# Altium project Front.PrjPCB (part 1 of 2)
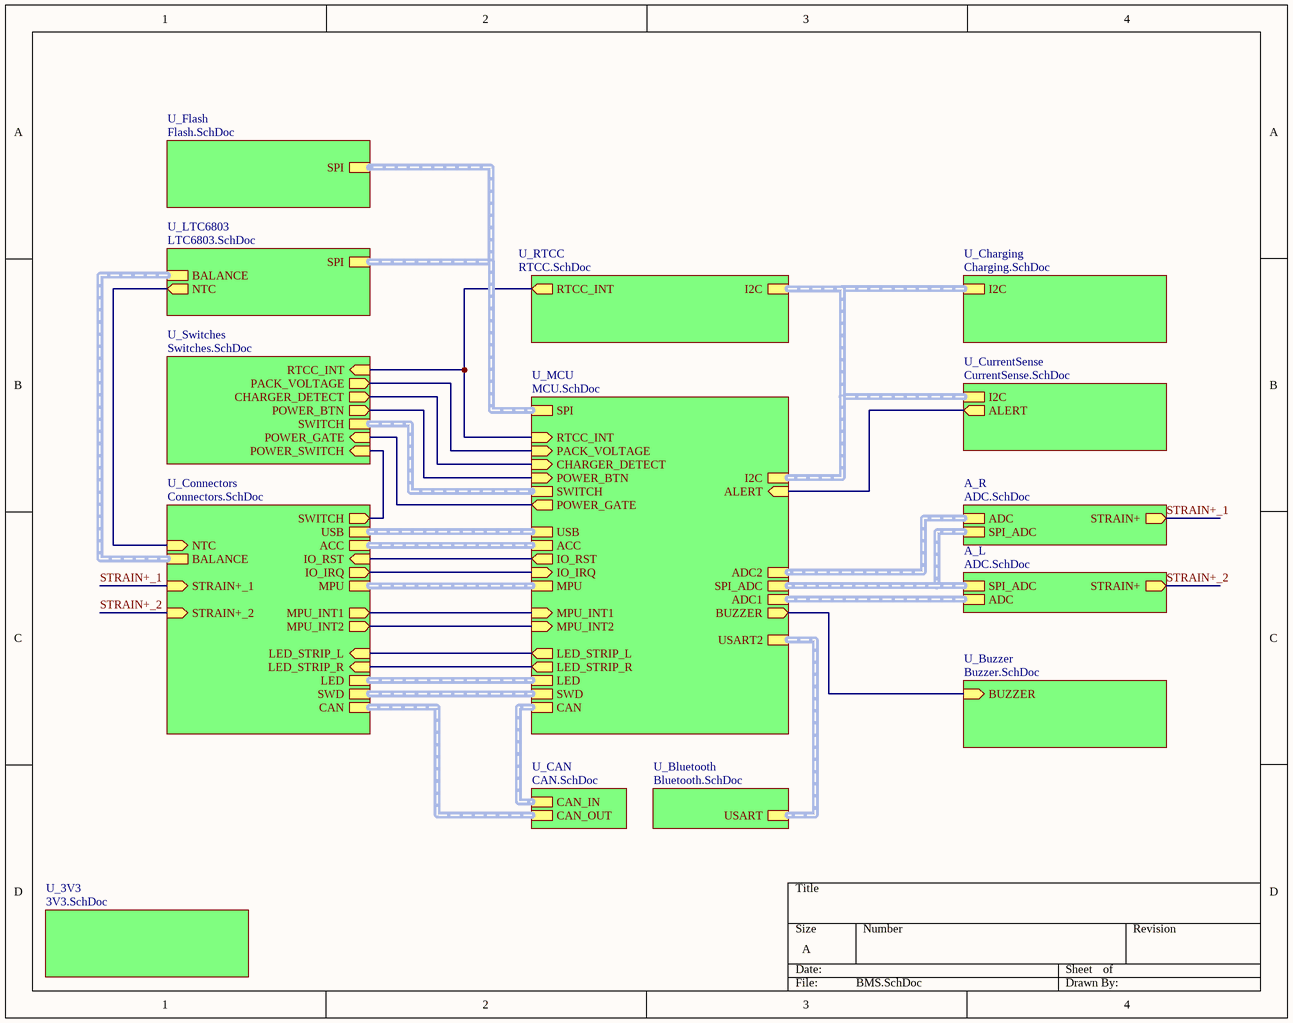
[diagram p0: BMS.SchDoc]
15 sheets, 320 parts. Net scope: hierarchical (ports join the sheet entries above them; power ports are global).
Board file: Front.PcbDoc
Sheets:
  BMS.SchDoc
    U_3V3 = 3V3.SchDoc
    U_MCU = MCU.SchDoc
    U_Switches = Switches.SchDoc
    U_Connectors = Connectors.SchDoc
    U_CAN = CAN.SchDoc
    U_RTCC = RTCC.SchDoc
    U_Buzzer = Buzzer.SchDoc
    A_L = ADC.SchDoc
    U_Charging = Charging.SchDoc
    U_Bluetooth = Bluetooth.SchDoc
    A_R = ADC.SchDoc
    U_CurrentSense = CurrentSense.SchDoc
    U_LTC6803 = LTC6803.SchDoc
      12 = Cell.SchDoc
      11 = Cell.SchDoc
      10 = Cell.SchDoc
      9 = Cell.SchDoc
      8 = Cell.SchDoc
      7 = Cell.SchDoc
      6 = Cell.SchDoc
      5 = Cell.SchDoc
      4 = Cell.SchDoc
      3 = Cell.SchDoc
      2 = Cell.SchDoc
      1 = Cell.SchDoc
    U_Flash = Flash.SchDoc

## Sheet BMS.SchDoc
size A; SheetNumber: 1

### Sub-sheets
A_L = ADC.SchDoc: SPI_ADC (harness SPI_ADC), ADC (harness ADC), STRAIN+ (out)
A_R = ADC.SchDoc: SPI_ADC (harness SPI_ADC), ADC (harness ADC), STRAIN+ (out)
U_3V3 = 3V3.SchDoc: no entries
U_Bluetooth = Bluetooth.SchDoc: USART (harness USART2)
U_Buzzer = Buzzer.SchDoc: BUZZER (in)
U_CAN = CAN.SchDoc: CAN_IN (harness CAN Input), CAN_OUT (harness CAN Output)
U_Charging = Charging.SchDoc: I2C (harness I2C)
U_Connectors = Connectors.SchDoc: USB (harness USB), ACC (harness Accessory Outputs), SWITCH (out), CAN (harness CAN Output), NTC (in), BALANCE (harness Balance), MPU (harness I2C), MPU_INT1 (out), MPU_INT2 (out), STRAIN+_1 (in), STRAIN+_2 (in), LED_STRIP_L (in), LED_STRIP_R (in), SWD (harness SWD), LED (harness LED), IO_RST (in), IO_IRQ (out)
U_CurrentSense = CurrentSense.SchDoc: ALERT (out), I2C (harness I2C)
U_Flash = Flash.SchDoc: SPI (harness SPI)
U_LTC6803 = LTC6803.SchDoc: SPI (harness SPI), NTC (out), BALANCE (harness Balance)
U_MCU = MCU.SchDoc: CHARGER_DETECT (in), POWER_BTN (in), POWER_GATE (out), USB (harness USB), CAN (harness CAN Input), ACC (harness Accessory Outputs), SWITCH (harness Switches), I2C (harness I2C), RTCC_INT (in), PACK_VOLTAGE (in), BUZZER (out), SPI_ADC (harness SPI_ADC), USART2 (harness USART2), ADC1 (harness ADC), ADC2 (harness ADC), MPU (harness I2C), MPU_INT1 (in), MPU_INT2 (in), ALERT (in), SPI, LED_STRIP_L (out), LED_STRIP_R (out), SWD (harness SWD), LED (harness LED), IO_RST (out), IO_IRQ (in)
U_RTCC = RTCC.SchDoc: I2C (harness I2C), RTCC_INT (out)
U_Switches = Switches.SchDoc: POWER_GATE (in), POWER_BTN (out), CHARGER_DETECT (out), SWITCH (harness Switches), POWER_SWITCH (in), RTCC_INT (in), PACK_VOLTAGE (out)

### Nets
STRAIN+_1: sheet U_Connectors/STRAIN+_1, sheet A_R/STRAIN+  [project net AINP]
STRAIN+_2: sheet U_Connectors/STRAIN+_2, sheet A_L/STRAIN+  [project net AINP]
NetC1_2: sheet U_Connectors/NTC, sheet U_LTC6803/NTC
NetJP4_2: sheet U_Switches/POWER_SWITCH, sheet U_Connectors/SWITCH
NetJP8_2: sheet U_MCU/LED_STRIP_L, sheet U_Connectors/LED_STRIP_L
NetJP9_2: sheet U_MCU/LED_STRIP_R, sheet U_Connectors/LED_STRIP_R
NetJP10_1: sheet U_MCU/MPU_INT1, sheet U_Connectors/MPU_INT1
NetJP11_1: sheet U_MCU/MPU_INT2, sheet U_Connectors/MPU_INT2
NetJP15_1: sheet U_MCU/IO_RST, sheet U_Connectors/IO_RST
NetJP15_2: sheet U_MCU/IO_IRQ, sheet U_Connectors/IO_IRQ
NetQ1_1: sheet U_MCU/POWER_BTN, sheet U_Switches/POWER_BTN
NetQ9_1: sheet U_MCU/RTCC_INT, sheet U_Switches/RTCC_INT, sheet U_RTCC/RTCC_INT
NetQ11_1: sheet U_MCU/POWER_GATE, sheet U_Switches/POWER_GATE
NetQ13_1: sheet U_MCU/BUZZER, sheet U_Buzzer/BUZZER
NetR22_2: sheet U_MCU/PACK_VOLTAGE, sheet U_Switches/PACK_VOLTAGE
NetR39_1: sheet U_MCU/CHARGER_DETECT, sheet U_Switches/CHARGER_DETECT
NetR52_1: sheet U_MCU/ALERT, sheet U_CurrentSense/ALERT

### Buses and harness runs
harness sheet A_L/ADC = sheet U_MCU/ADC1
harness sheet A_L/SPI_ADC = sheet A_R/SPI_ADC = sheet U_MCU/SPI_ADC
harness sheet A_R/ADC = sheet U_MCU/ADC2
harness sheet U_Bluetooth/USART = sheet U_MCU/USART2
harness sheet U_CAN/CAN_IN = sheet U_MCU/CAN
harness sheet U_CAN/CAN_OUT = sheet U_Connectors/CAN
harness sheet U_Charging/I2C = sheet U_CurrentSense/I2C = sheet U_MCU/I2C = sheet U_RTCC/I2C
harness sheet U_Connectors/ACC = sheet U_MCU/ACC
harness sheet U_Connectors/BALANCE = sheet U_LTC6803/BALANCE
harness sheet U_Connectors/LED = sheet U_MCU/LED
harness sheet U_Connectors/MPU = sheet U_MCU/MPU
harness sheet U_Connectors/SWD = sheet U_MCU/SWD
harness sheet U_Connectors/USB = sheet U_MCU/USB
harness sheet U_Flash/SPI = sheet U_LTC6803/SPI = sheet U_MCU/SPI
harness sheet U_MCU/SWITCH = sheet U_Switches/SWITCH

## Sheet 3V3.SchDoc
size A; SheetNumber: 2
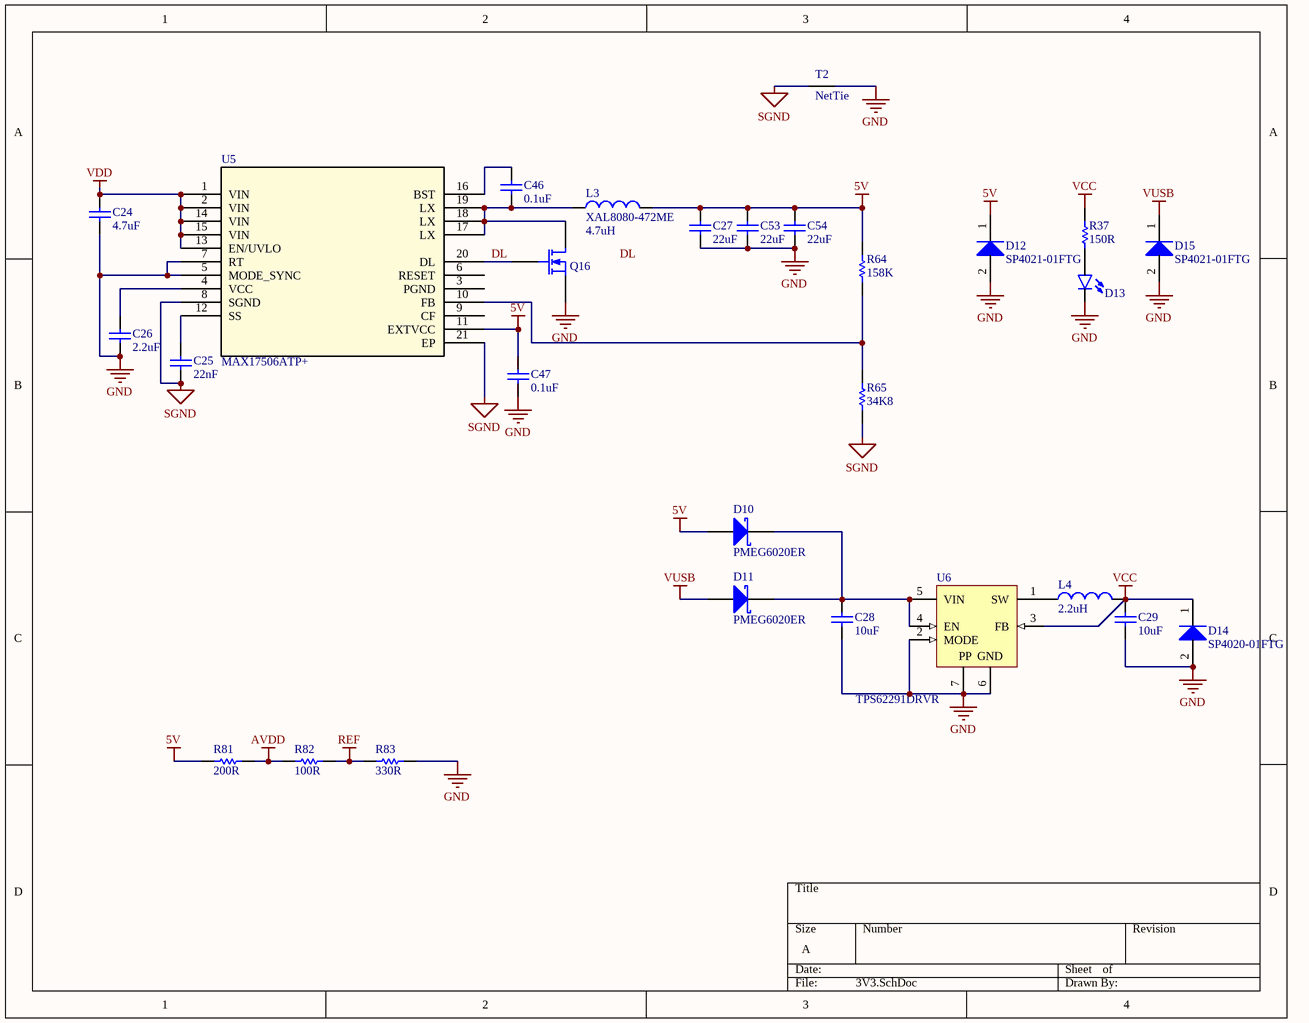
[diagram p1: 3V3.SchDoc]

### Parts
C24  value 4.7uF  [C1210[3225X200]]  (hidden comment: 4.7uF 100V 1210)
C25  value 22nF  [C0603[1608X92]]  (hidden comment: 22nF 50V 0603)
C26  value 2.2uF  [C0603[1608X92]]  (hidden comment: 2.2uF 10V 0603)
C27  value 22uF  [C1210[3225X250]]  (hidden comment: 22uF 16V 1210)
C28  value 10uF  [C0603[1608X92]]  (hidden comment: 10uF 16V 0603)
C29  value 10uF  [C0603[1608X92]]  (hidden comment: 10uF 6.3V 0603)
C46  value 0.1uF  [C0603[1608X92]]  (hidden comment: 0.1uF 16V 0603)
C47  value 0.1uF  [C0603[1608X92]]  (hidden comment: 0.1uF 6.3V 0603)
C53  value 22uF  [C1210[3225X250]]  (hidden comment: 22uF 16V 1210)
C54  value 22uF  [C1210[3225X250]]  (hidden comment: 22uF 16V 1210)
D10  PMEG6020ER  [SOD-123]
D11  PMEG6020ER  [SOD-123]
D12  SP4021-01FTG  [SOD-323]
D13  LED_0603_GREEN_5mA  [LED0603]  (value not drawn)
D14  SP4020-01FTG  [SOD-323]
D15  SP4021-01FTG  [SOD-323]
L3  XAL8080-472ME  value 4.7uH  [XAL8080]
L4  2.2uH  [IND0805]
Q16  SIS862DN-T1-GE3  [PowerPak-1212-8]  (value not drawn)
R37  value 150R  [R0603[1608]]  (hidden comment: 150R 1% 0603)
R64  value 158K  [R0603[1608]]  (hidden comment: 158K 1% 0603)
R65  value 34K8  [R0603[1608]]  (hidden comment: 34K8 1% 0603)
R81  value 200R  [R0603[1608]]  (hidden comment: 200R 1% 0603)
R82  value 100R  [R0603[1608]]  (hidden comment: 100R 1% 0603)
R83  value 330R  [R0603[1608]]  (hidden comment: 330R 1% 0603)
T2  NetTie  [NetTie]  (net tie, no BOM)
U5  MAX17506ATP+  [21-0140L_T2055-4]
U6  TPS62291DRVR  [WSON-6]

### Nets
5V: C27.2 C47.2 C53.2 C54.2 D10.2(A) D12.1(K) L3.2 R64.2 R81.1 U5.11(EXTVCC)
AVDD: R81.2 R82.1
GND: C24.1 C26.1 C27.1 C28.1 C29.1 C47.1 C53.1 C54.1 D12.2(A) D13.C D14.2(A) D15.2(A) Q16.1(S) R83.2 T2.2 U5.5(MODE_SYNC) U5.7(RT) U6.2(MODE) U6.6(GND) U6.7(EP)
REF: R82.2 R83.1
SGND: C25.1 R65.1 T2.1 U5.8(SGND) U5.21(EP)
VCC: C29.2 D14.1(K) L4.2 R37.2 U6.3(FB)
VDD: C24.2 U5.1(VIN) U5.2(VIN) U5.13(EN/UVLO) U5.14(VIN) U5.15(VIN)
VUSB: D11.2(A) D15.1(K)
DL: Q16.2(G) U5.20(DL)
NetC25_2: C25.2 U5.12(SS)
NetC26_2: C26.2 U5.4(VCC)
NetC28_2: C28.2 D10.1(K) D11.1(K) U6.4(EN) U6.5(VIN)
NetC46_1: C46.1 L3.1 Q16.3(D) U5.17(LX) U5.18(LX) U5.19(LX)
NetC46_2: C46.2 U5.16(BST)
NetD13_A: D13.A R37.1
NetL4_1: L4.1 U6.1(SW)
NetR64_1: R64.1 R65.2 U5.10(FB)

Not connected (* = marked no-connect by the designer): U5 3(PGND) 6(RESET) 9(CF)

### Notes on the sheet
- Labels drawn without touching a wire or pin: DL
- (in symbol TPS62291DRVR) PP

### Library data of the parts
C24 = CAP_4.7uF_100V_1210_10%: 4.7uF 100V 10% 1210 (3225 Metric); PartNumber: GRJ32DC72A475KE11L; Manufacturer: Murata; Mounting Technology: Surface Mount; PackageReference: 1210; PackageDescription: 1210 (3225 Metric); Voltage: 100V; Tolerance: 10%
C25 = CAP_22nF_50V_0603_10%: 22nF 50V 10% 0603 (1608 Metric); PartNumber: GRM188R71H223KA01D; Manufacturer: Murata; TemperatureCoefficient: X7R; Mounting Technology: Surface Mount; PackageReference: 0603; PackageDescription: 0603 (1608 Metric); Voltage: 50V; Tolerance: 10%
C26 = CAP_2.2uF_10V_0603_10%: 2.2uF 10V 10% 0603 (1608 Metric); PartNumber: GRT188R61A225KE13D; Manufacturer: Murata; TemperatureCoefficient: X5R; Mounting Technology: Surface Mount; PackageReference: 0603; PackageDescription: 0603 (1608 Metric); Voltage: 10V; Tolerance: 10%
C27 C53 C54 = CAP_22uF_16V_1210_20%_1: 22uF 16V 20% 1210 (3225 Metric); PartNumber: GRM32ER61C476ME15L; Manufacturer: Murata; Mounting Technology: Surface Mount; PackageReference: 1210; PackageDescription: 1210 (3225 Metric); Voltage: 16V; Tolerance: 20%
C28 = CAP_10uF_16V_0603_10%: 10uF 16V 10% 0603 (1608 Metric); PartNumber: GRM188R61C106KAALD; Manufacturer: Murata; TemperatureCoefficient: X5R; Mounting Technology: Surface Mount; PackageReference: 0603; PackageDescription: 0603 (1608 Metric); Voltage: 16V; Tolerance: 10%
C29 = CAP_10uF_6.3V_0603_10%: 10uF 6.3V 10% 0603 (1608 Metric); PartNumber: GRM188R60J106KE47D; Manufacturer: Murata; TemperatureCoefficient: X5R; Mounting Technology: Surface Mount; PackageReference: 0603; PackageDescription: 0603 (1608 Metric); Voltage: 6.3V; Tolerance: 10%
C46 = CAP_0.1uF_16V_0603_10%: 0.1uF 16V 10% 0603 (1608 Metric); PartNumber: GCM188R71C104KA37D; Manufacturer: Murata; TemperatureCoefficient: X7R; Mounting Technology: Surface Mount; PackageReference: 0603; PackageDescription: 0603 (1608 Metric); Voltage: 16V; Tolerance: 10%
C47 = CAP_0.1uF_6.3V_0603_10%: 0.1uF 6.3V 10% 0603 (1608 Metric); PartNumber: GRM188R70J104KA01D; Manufacturer: Murata; Mounting Technology: Surface Mount; PackageReference: 0603; PackageDescription: 0603 (1608 Metric); Voltage: 6.3V; Tolerance: 10%
D10 D11 = PMEG6020ER: PartNumber: PMEG6020ER,115; Manufacturer: NXP Semiconductors; PackageReference: SOD-123W; PackageDescription: SOD, 2-Leads, Body 2.69x1.6mm; Mounting Technology: Surface Mount
D12 D15 = SP4021-01FTG: Manufacturer: Littelfuse; PartNumber: SP4021-01FTG; PackageReference: SOD-323-2; Mounting Technology: Surface Mount
D13 = LED_0603_GREEN_5mA: PartNumber: LTST-C193TGKT-5A; Manufacturer: Lite-On Inc.; PackageReference: 0603; PackageDescription: 0603 (1608 Metric); Mounting Technology: Surface Mount
D14 = SP4020-01FTG: Manufacturer: Littelfuse; PartNumber: SP4020-01FTG; PackageReference: SOD-323-2; Mounting Technology: Surface Mount
L3 = XAL8080-472ME: 4.7uH 38A 4.08mOhms; PartNumber: XAL8080-472MED; Manufacturer: Coilcraft; Published: 8-Jun-2000; PackageReference: 0402-A; Publisher: Altium Limited; PackageDescription: Chip Inductor
L4 = IND_2.2uH_1.7A_0805_20%: 2.2uH 20% 1.7A 0805; PartNumber: LQM21PN2R2MGHL; Manufacturer: Murata; PackageReference: 0805; PackageDescription: 0805 (2012 metric); Value: 2.2uH; Mounting Technology: Surface Mount; Current: 1.7A
Q16 = SIS862DN-T1-GE3: N-Channel MOSFET; Manufacturer: Vishay; PartNumber: SIS862DN-T1-GE3; Mounting Technology: Surface Mount; PackageReference: PowerPAK-1212-8
R37 = RES_150R_0603_1%: 150R 0.25W 1% 0603 (1005 Metric); Manufacturer: Vishay / Dale; PartNumber: CRCW0603150RFKEAHP; Tolerance: 1%; Power: 0.25W; Mounting Technology: Surface Mount; PackageReference: 0603; PackageDescription: 0603 (1608 Metric); ComponentLink1Description: Datasheet; ComponentLink1URL: http://www.vishay.com/docs/20043/crcwhpe3.pdf
R64 = RES_158K_0603_1%: 158K 0.25W 1% 0603 (1005 Metric); Manufacturer: Vishay / Dale; PartNumber: CRCW0603158KFKEAHP; Tolerance: 1%; Power: 0.25W; Mounting Technology: Surface Mount; PackageReference: 0603; PackageDescription: 0603 (1608 Metric); ComponentLink1Description: Datasheet; ComponentLink1URL: http://www.vishay.com/docs/20043/crcwhpe3.pdf
R65 = RES_34K8_0603_1%: 34K8 0.25W 1% 0603 (1005 Metric); Manufacturer: Vishay / Dale; PartNumber: CRCW060334K8FKEAHP; Tolerance: 1%; Power: 0.25W; Mounting Technology: Surface Mount; PackageReference: 0603; PackageDescription: 0603 (1608 Metric); ComponentLink1Description: Datasheet; ComponentLink1URL: http://www.vishay.com/docs/20043/crcwhpe3.pdf
R81 = RES_200R_0603_1%: 200R 0.25W 1% 0603 (1005 Metric); Manufacturer: Vishay / Dale; PartNumber: CRCW0603200RFKEAHP; Tolerance: 1%; Power: 0.25W; Mounting Technology: Surface Mount; PackageReference: 0603; PackageDescription: 0603 (1608 Metric); ComponentLink1Description: Datasheet; ComponentLink1URL: http://www.vishay.com/docs/20043/crcwhpe3.pdf
R82 = RES_100R_0603_1%: 100R 0.25W 1% 0603 (1005 Metric); Manufacturer: Vishay / Dale; PartNumber: CRCW0603100RFKEAHP; Tolerance: 1%; Power: 0.25W; Mounting Technology: Surface Mount; PackageReference: 0603; PackageDescription: 0603 (1608 Metric); ComponentLink1Description: Datasheet; ComponentLink1URL: http://www.vishay.com/docs/20043/crcwhpe3.pdf
R83 = RES_330R_0603_1%: 330R 0.25W 1% 0603 (1005 Metric); Manufacturer: Vishay / Dale; PartNumber: CRCW0603330RFKEAHP; Tolerance: 1%; Power: 0.25W; Mounting Technology: Surface Mount; PackageReference: 0603; PackageDescription: 0603 (1608 Metric); ComponentLink1Description: Datasheet; ComponentLink1URL: http://www.vishay.com/docs/20043/crcwhpe3.pdf
U5 = MAX17506ATP+: Manufacturer: Maxim; Value: Value; Type: Type; RefDes: RefDes; PartNumber: MAX17506ATP+
U6 = TPS62291DRVR: Voltage Regulators - Switching Regulators 2.25MHz 1A Step-Down Cnvrtr 3.3V Output; Manufacturer: Texas Instruments; PartNumber: TPS62291DRVR; PackageReference: WSON-6; PackageDescription: SON, 6-Leads, Body 2x2mm, Pitch 0.65mm, Thermal Pad 1.6x1mm, TI Recommended; Mounting Technology: Surface Mount

## Sheet MCU.SchDoc
size A3; SheetNumber: 3
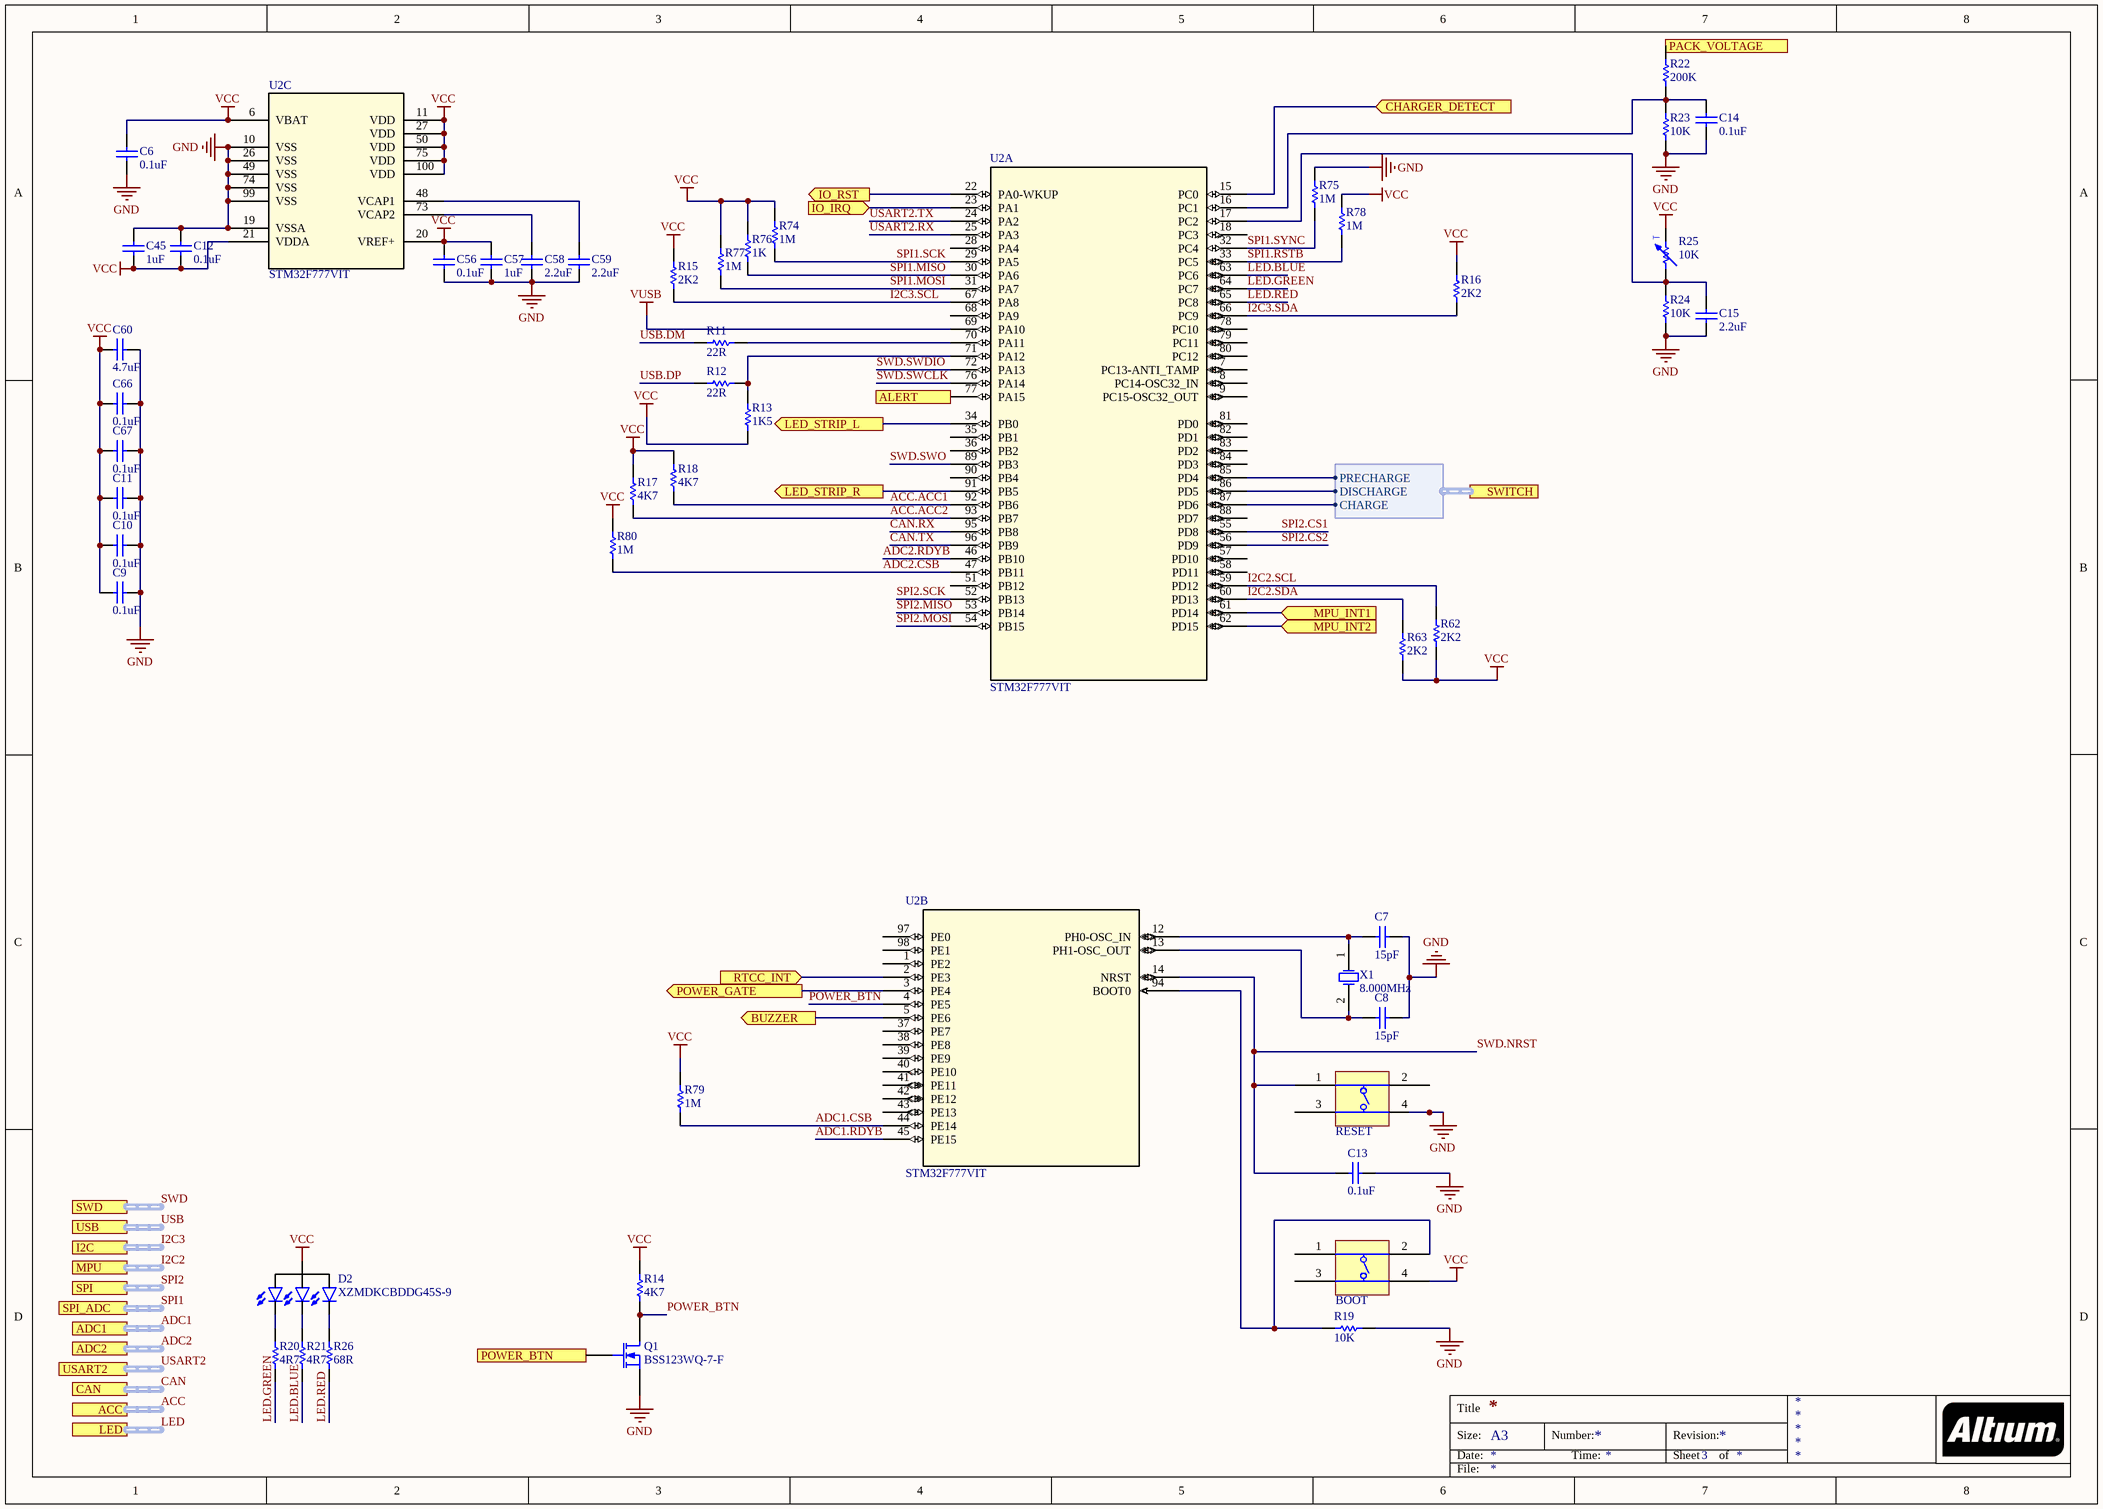
[diagram p2: MCU.SchDoc]

### Parts
BOOT  DIPT-DTSM-6  [SWITCH]  (value not drawn)
C6  value 0.1uF  [C0603[1608X92]]  (hidden comment: 0.1uF 6.3V 0603)
C7  value 15pF  [C0603[1608X92]]  (hidden comment: 15pF 6.3V 0603)
C8  value 15pF  [C0603[1608X92]]  (hidden comment: 15pF 6.3V 0603)
C9  value 0.1uF  [C0603[1608X92]]  (hidden comment: 0.1uF 6.3V 0603)
C10  value 0.1uF  [C0603[1608X92]]  (hidden comment: 0.1uF 6.3V 0603)
C11  value 0.1uF  [C0603[1608X92]]  (hidden comment: 0.1uF 6.3V 0603)
C12  value 0.1uF  [C0603[1608X92]]  (hidden comment: 0.1uF 6.3V 0603)
C13  value 0.1uF  [C0603[1608X92]]  (hidden comment: 0.1uF 6.3V 0603)
C14  value 0.1uF  [C0603[1608X92]]  (hidden comment: 0.1uF 6.3V 0603)
C15  value 2.2uF  [C0603[1608X92]]  (hidden comment: 2.2uF 6.3V 0603)
C45  value 1uF  [C0603[1608X92]]  (hidden comment: 1uF 6.3V 0603)
C56  value 0.1uF  [C0603[1608X92]]  (hidden comment: 0.1uF 6.3V 0603)
C57  value 1uF  [C0603[1608X92]]  (hidden comment: 1uF 6.3V 0603)
C58  value 2.2uF  [C1206[3216X160]]  (hidden comment: 2.2uF 6.3V 1206)
C59  value 2.2uF  [C1206[3216X160]]  (hidden comment: 2.2uF 6.3V 1206)
C60  value 4.7uF  [C0603[1608X92]]  (hidden comment: 4.7uF 6.3V 0603)
C66  value 0.1uF  [C0603[1608X92]]  (hidden comment: 0.1uF 6.3V 0603)
C67  value 0.1uF  [C0603[1608X92]]  (hidden comment: 0.1uF 6.3V 0603)
D2  XZMDKCBDDG45S-9  [XZMDKCBDDG45S-9]
Q1  BSS123WQ-7-F  [SOT323-3]
R11  value 22R  [R0603[1608]]  (hidden comment: 22R 1% 0603)
R12  value 22R  [R0603[1608]]  (hidden comment: 22R 1% 0603)
R13  value 1K5  [R0603[1608]]  (hidden comment: 1K5 1% 0603)
R14  value 4K7  [R0603[1608]]  (hidden comment: 4K7 1% 0603)
R15  value 2K2  [R0603[1608]]  (hidden comment: 2K2 1% 0603)
R16  value 2K2  [R0603[1608]]  (hidden comment: 2K2 1% 0603)
R17  value 4K7  [R0603[1608]]  (hidden comment: 4K7 1% 0603)
R18  value 4K7  [R0603[1608]]  (hidden comment: 4K7 1% 0603)
R19  value 10K  [R0603[1608]]  (hidden comment: 10K 1% 0603)
R20  value 4R7  [R0603[1608]]  (hidden comment: 4R7 1% 0603)
R21  value 4R7  [R0603[1608]]  (hidden comment: 4R7 1% 0603)
R22  value 200K  [R0603[1608]]  (hidden comment: 200K 1% 0603)
R23  value 10K  [R0603[1608]]  (hidden comment: 10K 1% 0603)
R24  value 10K  [R0603[1608]]  (hidden comment: 10K 1% 0603)
R25  value 10K  [R0603[1608]]  (hidden comment: 10K 0.5% 0603)
R26  value 68R  [R0603[1608]]  (hidden comment: 68R 1% 0603)
R62  value 2K2  [R0603[1608]]  (hidden comment: 2K2 1% 0603)
R63  value 2K2  [R0603[1608]]  (hidden comment: 2K2 1% 0603)
R74  value 1M  [R0603[1608]]  (hidden comment: 1M 1% 0603)
R75  value 1M  [R0603[1608]]  (hidden comment: 1M 1% 0603)
R76  value 1K  [R0603[1608]]  (hidden comment: 1K 1% 0603)
R77  value 1M  [R0603[1608]]  (hidden comment: 1M 1% 0603)
R78  value 1M  [R0603[1608]]  (hidden comment: 1M 1% 0603)
R79  value 1M  [R0603[1608]]  (hidden comment: 1M 1% 0603)
R80  value 1M  [R0603[1608]]  (hidden comment: 1M 1% 0603)
RESET  DIPT-DTSM-6  [SWITCH]  (value not drawn)
U2  STM32F777VIT  [LQFP-100_14X14mm]  (parts A,B,C of 3)
X1  8.000MHz  [OSC_2SM_3R2x2R5]

### Ports
ACC (harness Accessory Outputs), ADC1 (harness ADC), ADC2 (harness ADC), ALERT (in), BUZZER (out), CAN (harness CAN Input), CHARGER_DETECT (in), I2C (harness I2C), IO_IRQ (in), IO_RST (out), LED (harness LED), LED_STRIP_L (out), LED_STRIP_R (out), MPU (harness I2C), MPU_INT1 (in), MPU_INT2 (in), PACK_VOLTAGE (in), POWER_BTN (in), POWER_GATE (out), RTCC_INT (in), SPI (harness SPI), SPI_ADC (harness SPI_ADC), SWD (harness SWD), SWITCH (harness Switches), USART2 (harness USART2), USB (harness USB)

### Harnesses
Switches: CHARGE, DISCHARGE, PRECHARGE

### Nets
GND: C6.1 C7.2 C8.2 C9.2 C10.2 C11.2 C12.2 C13.2 C14.1 C15.1 C45.2 C56.1 C57.1 C58.1 C59.1 C60.2 C66.2 C67.2 Q1.2(S) R19.2 R23.1 R24.1 R75.2 RESET.4 U2.10(VSS) U2.19(VSSA) U2.26(VSS) U2.49(VSS) U2.74(VSS) U2.99(VSS)
VCC: BOOT.4 C6.2 C9.1 C10.1 C11.1 C12.1 C45.1 C56.2 C57.2 C60.1 C66.1 C67.1 D2.2(A) R13.1 R14.2 R15.1 R16.1 R17.2 R18.2 R25.2 R62.1 R63.1 R74.1 R76.1 R77.1 R78.2 R79.1 R80.1 U2.6(VBAT) U2.11(VDD) U2.20(VREF+) U2.21(VDDA) U2.27(VDD) U2.50(VDD) U2.75(VDD) U2.100(VDD)
VUSB: U2.69(PA10)
ACC.ACC1: R18.1 U2.92(PB6)
ACC.ACC2: R17.1 U2.93(PB7)
ADC1.CSB: R79.2 U2.44(PE14)
ADC1.RDYB: U2.45(PE15)
ADC2.CSB: R80.2 U2.47(PB11)
ADC2.RDYB: U2.46(PB10)
CAN.RX: U2.95(PB8)
CAN.TX: U2.96(PB9)
I2C2.SCL: R62.2 U2.59(PD12)
I2C2.SDA: R63.2 U2.60(PD13)
I2C3.SCL: R15.2 U2.67(PA8)
I2C3.SDA: R16.2 U2.66(PC9)
LED.BLUE: R21.1 U2.63(PC6)
LED.GREEN: R20.1 U2.64(PC7)
LED.RED: R26.1 U2.65(PC8)
POWER_BTN: Q1.3(D) R14.1 U2.4(PE5)
SPI1.MISO: R76.2 U2.30(PA6)
SPI1.MOSI: R77.2 U2.31(PA7)
SPI1.RSTB: R78.1 U2.33(PC5)
SPI1.SCK: R74.2 U2.29(PA5)
SPI1.SYNC: R75.1 U2.32(PC4)
SPI2.CS1: U2.55(PD8)
SPI2.CS2: U2.56(PD9)
SPI2.MISO: U2.53(PB14)
SPI2.MOSI: U2.54(PB15)
SPI2.SCK: U2.52(PB13)
SWD.NRST: C13.1 RESET.1 U2.14(NRST)
SWD.SWCLK: U2.76(PA14)
SWD.SWDIO: U2.72(PA13)
SWD.SWO: U2.89(PB3)
USART2.RX: U2.25(PA3)
USART2.TX: U2.24(PA2)
USB.DM: R11.1
USB.DP: R12.1
NetBOOT_2: BOOT.2 R19.1 U2.94(BOOT0)
NetC7_1: C7.1 U2.12(PH0-OSC_IN) X1.1(OSC1)
NetC8_1: C8.1 U2.13(PH1-OSC_OUT) X1.2(OSC2)
NetC14_2: C14.2 R22.1 R23.2 U2.16(PC1)
NetC15_2: C15.2 R24.2 R25.1 U2.17(PC2)
NetC58_2: C58.2 U2.73(VCAP2)
NetC59_2: C59.2 U2.48(VCAP1)
NetD2_1: D2.1(K_Red) R26.2
NetD2_3: D2.3(K_Blue) R21.2
NetD2_4: D2.4(K_Green) R20.2
NetJP8_2: U2.34(PB0) ; port LED_STRIP_L
NetJP9_2: U2.91(PB5) ; port LED_STRIP_R
NetJP10_1: U2.61(PD14) ; port MPU_INT1
NetJP11_1: U2.62(PD15) ; port MPU_INT2
NetJP15_1: U2.22(PA0-WKUP) ; port IO_RST
NetJP15_2: U2.23(PA1) ; port IO_IRQ
NetQ1_1: Q1.1(G) ; port POWER_BTN
NetQ9_1: U2.2(PE3) ; port RTCC_INT
NetQ11_1: U2.3(PE4) ; port POWER_GATE
NetQ13_1: U2.5(PE6) ; port BUZZER
NetR11_2: R11.2 U2.70(PA11)
NetR12_2: R12.2 R13.2 U2.71(PA12)
NetR22_2: R22.2 ; port PACK_VOLTAGE
NetR39_1: U2.15(PC0) ; port CHARGER_DETECT
NetR52_1: U2.77(PA15) ; port ALERT
NetU2_85: U2.85(PD4) ; port SWITCH.PRECHARGE
NetU2_86: U2.86(PD5) ; port SWITCH.DISCHARGE
NetU2_87: U2.87(PD6) ; port SWITCH.CHARGE

Not connected (* = marked no-connect by the designer): BOOT 1 3; RESET 2 3; U2 1(PE2) 7(PC13-ANTI_TAMP) 8(PC14-OSC32_IN) 9(PC15-OSC32_OUT) 18(PC3) 28(PA4) 35(PB1) 36(PB2) 37(PE7) 38(PE8) 39(PE9) 40(PE10) 41(PE11) 42(PE12) 43(PE13) 51(PB12) 57(PD10) 58(PD11) 68(PA9) 78(PC10) 79(PC11) 80(PC12) 81(PD0) 82(PD1) 83(PD2) 84(PD3) 88(PD7) 90(PB4) 97(PE0) 98(PE1)

### Buses and harness runs
harness ACC = port ACC
harness ADC1 = port ADC1
harness ADC2 = port ADC2
harness CAN = port CAN
harness I2C2 = port MPU
harness I2C3 = port I2C
harness LED = port LED
harness SPI1 = port SPI_ADC
harness SPI2 = port SPI
harness SWD = port SWD
harness USART2 = port USART2
harness USB = port USB

### Notes on the sheet
- Title
- Size:
- Date:
- A3
- Number:
- Time:
- Revision:
- Sheet
- of
- File:
- (in symbol NTC_10K_0603_0.5%) T

### Library data of the parts
BOOT RESET = DIPT-DTSM-6: Manufacturer: Wurth; PartNumber: 430182050816
C6 C9-C14 C56 C66 C67 = CAP_0.1uF_6.3V_0603_10%: as C47 on sheet 3V3; Mounting Technology: Surface Mount; PackageReference: 0603; PackageDescription: 0603 (1608 Metric); Voltage: 6.3V; Tolerance: 10%
C7 C8 = CAP_15pF_6.3V_0603_1%: 15pF 6.3V 1% 0603 (1608 Metric); PartNumber: CBR02C150F9GAC; Manufacturer: KEMET; TemperatureCoefficient: C0G; Mounting Technology: Surface Mount; PackageReference: 0603; PackageDescription: 0603 (1608 Metric); Voltage: 6.3V; Tolerance: 1%
C15 = CAP_2.2uF_6.3V_0603_10%: 2.2uF 6.3V 10% 0603 (1608 Metric); PartNumber: GRM185R60J225KE26D; Manufacturer: Murata; TemperatureCoefficient: X5R; Mounting Technology: Surface Mount; PackageReference: 0603; PackageDescription: 0603 (1608 Metric); Voltage: 6.3V; Tolerance: 10%
C45 C57 = CAP_1uF_6.3V_0603_10%: 1uF 6.3V 10% 0603 (1608 Metric); PartNumber: GRM188R60J105KA01D; Manufacturer: Murata; TemperatureCoefficient: X5R; Mounting Technology: Surface Mount; PackageReference: 0603; PackageDescription: 0603 (1608 Metric); Voltage: 6.3V; Tolerance: 10%
C58 C59 = CAP_2.2uF_16V_1206_10%: 2.2uF 6.3V 10% 1206 (3216 Metric); PartNumber: GRM31CR60J476KE19L; Manufacturer: Murata; Voltage: 16V; Mounting Technology: Surface Mount; PackageReference: 1206; PackageDescription: 1206 (3216 Metric); Tolerance: 10%
C60 = CAP_4.7uF_6.3V_0603_10%: 4.7uF 6.3V 10% 0603 (1608 Metric); PartNumber: GRM188R60J475KE19D; Manufacturer: Murata; TemperatureCoefficient: X5R; Mounting Technology: Surface Mount; PackageReference: 0603; PackageDescription: 0603 (1608 Metric); Voltage: 6.3V; Tolerance: 10%
D2 = XZMDKCBDDG45S-9: Manufacturer: SunLED; PartNumber: XZMDKCBDDG45S-9; PackageReference: 4-PLCC; Mounting Technology: Surface Mount; PackageDescription: 4-SMD, Gull Wing,  3.20mm L x 2.80mm W
Q1 = BSS123WQ-7-F: N-Channel MOSFET; Manufacturer: Diodes Incorporated; PackageReference: SOT-323-3; PartNumber: BSS123WQ-7-F; Mounting Technology: Surface Mount
R11 R12 = RES_22R_0603_1%: 22R 0.25W 1% 0603 (1005 Metric); Manufacturer: Vishay / Dale; PartNumber: CRCW060322R0FKEAHP; Tolerance: 1%; Power: 0.25W; Mounting Technology: Surface Mount; PackageReference: 0603; PackageDescription: 0603 (1608 Metric); ComponentLink1Description: Datasheet; ComponentLink1URL: http://www.vishay.com/docs/20043/crcwhpe3.pdf
R13 = RES_1K5_0603_1%: 1K5 0.25W 1% 0603 (1005 Metric); Manufacturer: Vishay / Dale; PartNumber: CRCW06031K50FKEAHP; Tolerance: 1%; Power: 0.25W; Mounting Technology: Surface Mount; PackageReference: 0603; PackageDescription: 0603 (1608 Metric); ComponentLink1Description: Datasheet; ComponentLink1URL: http://www.vishay.com/docs/20043/crcwhpe3.pdf
R14 R17 R18 = RES_4K7_0603_1%: 4K7 0.25W 1% 0603 (1005 Metric); Manufacturer: Vishay / Dale; PartNumber: CRCW06034K70FKEAHP; Tolerance: 1%; Power: 0.25W; Mounting Technology: Surface Mount; PackageReference: 0603; PackageDescription: 0603 (1608 Metric); ComponentLink1Description: Datasheet; ComponentLink1URL: http://www.vishay.com/docs/20043/crcwhpe3.pdf
R15 R16 R62 R63 = RES_2K2_0603_1%: 2K2 0.25W 1% 0603 (1005 Metric); Manufacturer: Vishay / Dale; PartNumber: CRCW06032K20FKEAHP; Tolerance: 1%; Power: 0.25W; Mounting Technology: Surface Mount; PackageReference: 0603; PackageDescription: 0603 (1608 Metric); ComponentLink1Description: Datasheet; ComponentLink1URL: http://www.vishay.com/docs/20043/crcwhpe3.pdf
R19 R23 R24 = RES_10K_0603_1%: 10K 0.25W 1% 0603 (1005 Metric); Manufacturer: Vishay; PartNumber: RCS060310K0FKEA; Tolerance: 1%; Power: 0.25W; Mounting Technology: Surface Mount; PackageReference: 0603; PackageDescription: 0603 (1608 Metric); ComponentLink1Description: Datasheet; ComponentLink1URL: http://www.vishay.com/docs/20065/rcse3.pdf
R20 R21 = RES_4R7_0603_1%: 4R7 0.25W 1% 0603 (1005 Metric); Manufacturer: Vishay / Dale; PartNumber: CRCW06034R70JNEAHP; Tolerance: 1%; Power: 0.25W; Mounting Technology: Surface Mount; PackageReference: 0603; PackageDescription: 0603 (1608 Metric); ComponentLink1Description: Datasheet; ComponentLink1URL: http://www.vishay.com/docs/20043/crcwhpe3.pdf
R22 = RES_200K_0603_1%: 200K 0.25W 1% 0603 (1005 Metric); Manufacturer: Rohm Semiconductor; PartNumber: ESR03EZPJ204; Tolerance: 5%; Power: 0.25W; Mounting Technology: Surface Mount; PackageReference: 0603; PackageDescription: 0603 (1608 Metric); ComponentLink1Description: Datasheet; ComponentLink1URL: http://www.vishay.com/docs/20043/crcwhpe3.pdf
R25 = NTC_10K_0603_0.5%: NTC 10K 0.5% 0603 (1608 Metric); PartNumber: NCP18XH103D60RC; Manufacturer: Murata; Power: 0.1W; Mounting Technology: Surface Mount; PackageReference: 0603; PackageDescription: 0603 (1608 Metric); Tolerance: 0.5%
R26 = RES_68R_0603_1%: 68R 0.25W 1% 0603 (1005 Metric); Manufacturer: Vishay / Dale; PartNumber: CRCW06036R80FKEAHP; Tolerance: 1%; Power: 0.25W; Mounting Technology: Surface Mount; PackageReference: 0603; PackageDescription: 0603 (1608 Metric); ComponentLink1Description: Datasheet; ComponentLink1URL: http://www.vishay.com/docs/20043/crcwhpe3.pdf
R74 R75 R77-R80 = RES_1M_0603_1%: 1M 0.25W 1% 0603 (1005 Metric); Manufacturer: Vishay / Dale; PartNumber: CRCW06031M00JNEAHP; Tolerance: 5%; Power: 0.25W; Mounting Technology: Surface Mount; PackageReference: 0603; PackageDescription: 0603 (1608 Metric); ComponentLink1Description: Datasheet; ComponentLink1URL: http://www.vishay.com/docs/20043/crcwhpe3.pdf
R76 = RES_1K_0603_1%: 1K 0.25W 1% 0603 (1005 Metric); Manufacturer: Vishay / Dale; PartNumber: CRCW06031K00FKEAHP; Tolerance: 1%; Power: 0.25W; Mounting Technology: Surface Mount; PackageReference: 0603; PackageDescription: 0603 (1608 Metric); ComponentLink1Description: Datasheet; ComponentLink1URL: http://www.vishay.com/docs/20043/crcwhpe3.pdf
U2 = STM32F777VIT: Imported; Manufacturer: STMicroelectronics; Value: Value; Type: Type; RefDes: RefDes; PartNumber: STM32F777VIT
X1 = XTAL: Crystal Oscillator; Manufacturer: NX; PartNumber: NX3225GD-8.000M-EXS00A-CG04874; PackageReference: R38; Value: 8.000MHz

## Sheet Switches.SchDoc
size A; SheetNumber: 7
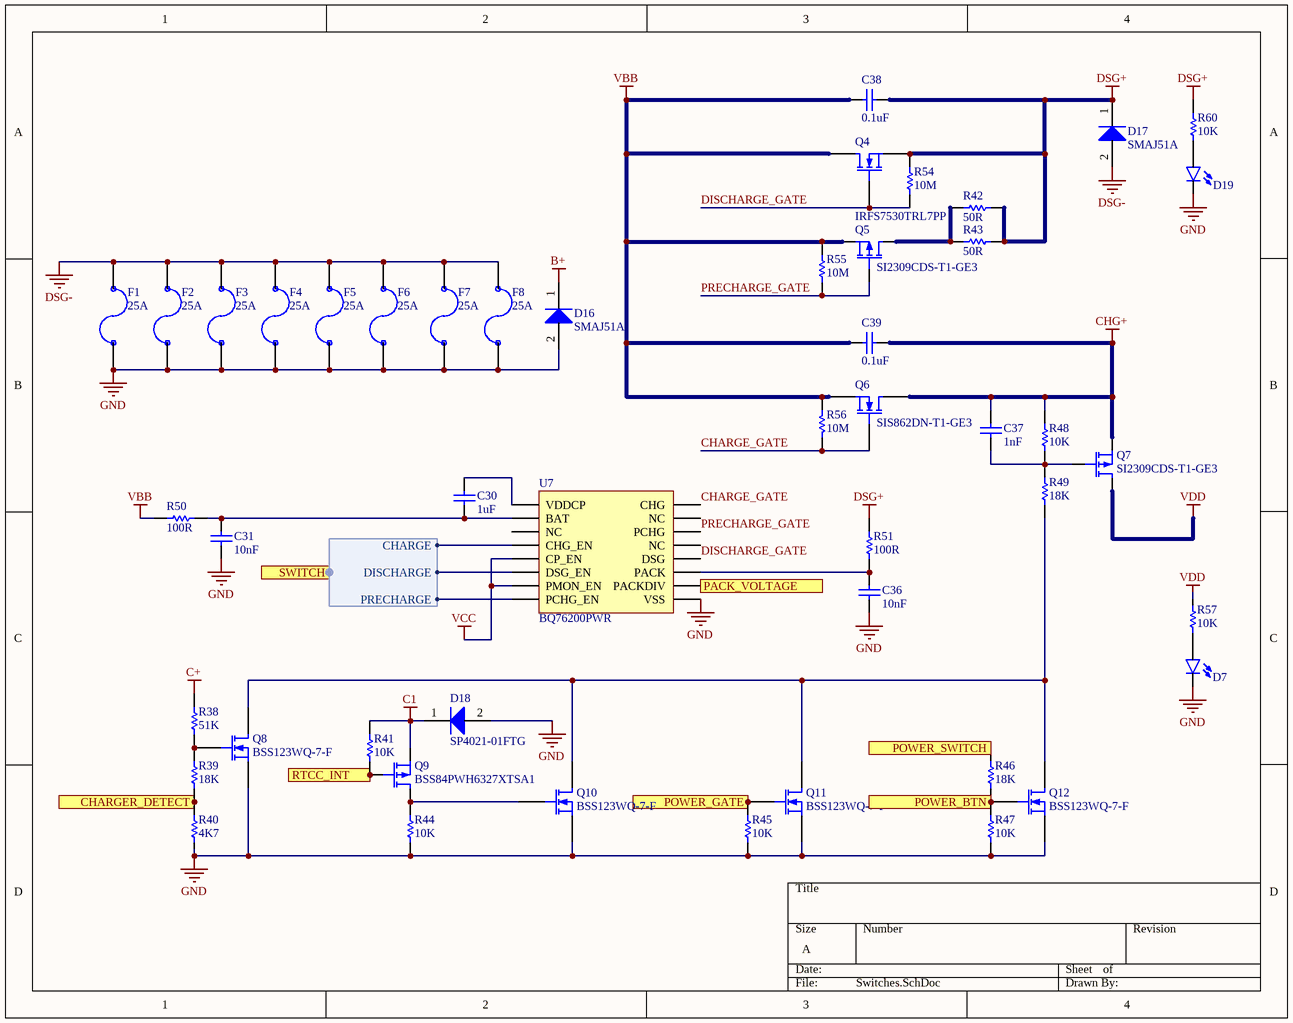
[diagram p3: Switches.SchDoc]

### Parts
C30  value 1uF  [C0603[1608X92]]  (hidden comment: 1uF 50V 0603)
C31  value 10nF  [C0603[1608X92]]  (hidden comment: 10nF 100V 0603)
C36  value 10nF  [C0603[1608X92]]  (hidden comment: 10nF 100V 0603)
C37  value 1nF  [C0603[1608X92]]  (hidden comment: 1nF 50V 0603)
C38  value 0.1uF  [C0603[1608X92]]  (hidden comment: 0.1uF 100V 0603)
C39  value 0.1uF  [C0603[1608X92]]  (hidden comment: 0.1uF 100V 0603)
D7  LED_0603_GREEN_5mA  [LED0603]  (value not drawn)
D16  SMAJ51A  [DO-214AC]
D17  SMAJ51A  [DO-214AC]
D18  SP4021-01FTG  [SOD-323]
D19  LED_0603_GREEN_5mA  [LED0603]  (value not drawn)
F1  Current: 25A  [1206_FUSE]  (hidden comment: FUSE 1206)
F2  Current: 25A  [1206_FUSE]  (hidden comment: FUSE 1206)
F3  Current: 25A  [1206_FUSE]  (hidden comment: FUSE 1206)
F4  Current: 25A  [1206_FUSE]  (hidden comment: FUSE 1206)
F5  Current: 25A  [1206_FUSE]  (hidden comment: FUSE 1206)
F6  Current: 25A  [1206_FUSE]  (hidden comment: FUSE 1206)
F7  Current: 25A  [1206_FUSE]  (hidden comment: FUSE 1206)
F8  Current: 25A  [1206_FUSE]  (hidden comment: FUSE 1206)
Q4  IRFS7530TRL7PP  [D2PAK-7]
Q5  SI2309CDS-T1-GE3  [SOT23-3]
Q6  SIS862DN-T1-GE3  [PowerPak-1212-8]
Q7  SI2309CDS-T1-GE3  [SOT23-3]
Q8  BSS123WQ-7-F  [SOT323-3]
Q9  BSS84PWH6327XTSA1  [SOT323-3]
Q10  BSS123WQ-7-F  [SOT323-3]
Q11  BSS123WQ-7-F  [SOT323-3]
Q12  BSS123WQ-7-F  [SOT323-3]
R38  value 51K  [R0603[1608]]  (hidden comment: 51K 1% 0603)
R39  value 18K  [R0603[1608]]  (hidden comment: 18K 1% 0603)
R40  value 4K7  [R0603[1608]]  (hidden comment: 4K7 1% 0603)
R41  value 10K  [R0603[1608]]  (hidden comment: 10K 1% 0603)
R42  value 50R  [R1206[3216]]  (hidden comment: 50R 2% 1206)
R43  value 50R  [R1206[3216]]  (hidden comment: 50R 2% 1206)
R44  value 10K  [R0603[1608]]  (hidden comment: 10K 1% 0603)
R45  value 10K  [R0603[1608]]  (hidden comment: 10K 1% 0603)
R46  value 18K  [R0603[1608]]  (hidden comment: 18K 1% 0603)
R47  value 10K  [R0603[1608]]  (hidden comment: 10K 1% 0603)
R48  value 10K  [R0603[1608]]  (hidden comment: 10K 1% 0603)
R49  value 18K  [R0603[1608]]  (hidden comment: 18K 1% 0603)
R50  value 100R  [R0603[1608]]  (hidden comment: 100R 1% 0603)
R51  value 100R  [R0603[1608]]  (hidden comment: 100R 1% 0603)
R54  value 10M  [R0603[1608]]  (hidden comment: 10M 1% 0603)
R55  value 10M  [R0603[1608]]  (hidden comment: 10M 1% 0603)
R56  value 10M  [R0603[1608]]  (hidden comment: 10M 1% 0603)
R57  value 10K  [R0603[1608]]  (hidden comment: 10K 1% 0603)
R60  value 10K  [R0603[1608]]  (hidden comment: 10K 1% 0603)
U7  BQ76200PWR  [TSSOP-16]

### Ports
CHARGER_DETECT (out), PACK_VOLTAGE (out), POWER_BTN (out), POWER_GATE (in), POWER_SWITCH (in), RTCC_INT (in), SWITCH (harness Switches)

### Harnesses
Switches: CHARGE, DISCHARGE, PRECHARGE

### Nets
B+: D16.1(K)
C1: D18.1(K) Q9.2(S) R41.2
C+: R38.2
CHG+: C37.2 C39.2 Q6.3(D) Q7.3(S) R48.2
DSG+: C38.2 D17.1(K) Q4.2(S) R42.2 R43.2 R51.2 R54.2 R60.2
DSG-: D17.2(A) F1.1 F2.1 F3.1 F4.1 F5.1 F6.1 F7.1 F8.1
GND: C31.1 C36.1 D7.C D16.2(A) D18.2(A) D19.C F1.2 F2.2 F3.2 F4.2 F5.2 F6.2 F7.2 F8.2 Q8.2(S) Q10.2(S) Q11.2(S) Q12.2(S) R40.1 R44.1 R45.1 R47.1 U7.9(VSS)
VBB: C38.1 C39.1 Q4.3(D) Q5.3(S) Q6.1(S) R50.1 R55.2 R56.2
VCC: U7.5(CP_EN) U7.7(PMON_EN)
VDD: Q7.2(D) R57.2
CHARGE_GATE: Q6.2(G) R56.1 U7.16(CHG)
DISCHARGE_GATE: Q4.1(G) R54.1 U7.12(DSG)
PRECHARGE_GATE: Q5.1(G) R55.1 U7.14(PCHG)
NetC30_1: C30.1 C31.2 R50.2 U7.2(BAT)
NetC30_2: C30.2 U7.1(VDDCP)
NetC36_2: C36.2 R51.1 U7.11(PACK)
NetC37_1: C37.1 Q7.1(G) R48.1 R49.2
NetD7_A: D7.A R57.1
NetD19_A: D19.A R60.1
NetJP4_2: R46.2 ; port POWER_SWITCH
NetQ1_1: Q12.1(G) R46.1 R47.2 ; port POWER_BTN
NetQ5_2: Q5.2(D) R42.1 R43.1
NetQ8_1: Q8.1(G) R38.1 R39.2
NetQ8_3: Q8.3(D) Q10.3(D) Q11.3(D) Q12.3(D) R49.1
NetQ9_1: Q9.1(G) R41.1 ; port RTCC_INT
NetQ9_3: Q9.3(D) Q10.1(G) R44.2
NetQ11_1: Q11.1(G) R45.2 ; port POWER_GATE
NetR22_2: U7.10(PACKDIV) ; port PACK_VOLTAGE
NetR39_1: R39.1 R40.2 ; port CHARGER_DETECT
NetU2_85: U7.8(PCHG_EN) ; port SWITCH.PRECHARGE
NetU2_86: U7.6(DSG_EN) ; port SWITCH.DISCHARGE
NetU2_87: U7.4(CHG_EN) ; port SWITCH.CHARGE

Not connected (* = marked no-connect by the designer): U7 3(NC) 13(NC) 15(NC)

### Library data of the parts
C30 = CAP_1uF_50V_0603_10%: 1uF 50V 10% 0603 (1608 Metric); PartNumber: GRM188R61H105KAALD; Manufacturer: Murata; TemperatureCoefficient: X5R; Tolerance: 10%; Mounting Technology: Surface Mount; PackageReference: 0603; PackageDescription: 0603 (1608 Metric); Voltage: 50V
C31 C36 = CAP_10nF_100V_0603_10%: 10nF 100V 10% 0603 (1608 Metric); PartNumber: GRM188R72A103KA01D; Manufacturer: Murata; TemperatureCoefficient: X7R; Tolerance: 10%; Mounting Technology: Surface Mount; PackageReference: 0603; PackageDescription: 0603 (1608 Metric); Voltage: 100V
C37 = CAP_1nF_50V_0603_5%: 1nF 50V 5% 0603 (1608 Metric); PartNumber: GRM1885C1H102JA01D; Manufacturer: Murata; TemperatureCoefficient: C0G; Mounting Technology: Surface Mount; PackageReference: 0603; PackageDescription: 0603 (1608 Metric); Voltage: 50V; Tolerance: 5%
C38 C39 = CAP_0.1uF_100V_0603_10%: 0.1uF 100V 10% 0603 (1608 Metric); PartNumber: GRM188R72A104KA35D; Manufacturer: Murata; TemperatureCoefficient: X7R; Mounting Technology: Surface Mount; PackageReference: 0603; PackageDescription: 0603 (1608 Metric); Voltage: 100V; Tolerance: 10%
D7 D19 = LED_0603_GREEN_5mA: as D13 on sheet 3V3; PackageReference: 0603; PackageDescription: 0603 (1608 Metric); Mounting Technology: Surface Mount
D16 D17 = SMAJ51A-E3/61: Manufacturer: Vishay; PartNumber: SMAJ51A-E3/61; PackageReference: DO-214AC; Mounting Technology: Surface Mount; PackageDescription: DO-214AC, 2 Leads
D18 = SP4021-01FTG: Manufacturer: Littelfuse; PartNumber: SP4021-01FTG; PackageReference: SOD-323-2; Mounting Technology: Surface Mount
F1-F8 = FUSE 1206: Surface Mount Fuses UST 1206 FUSE 25A F; PartNumber: 3413.0332.22; Manufacturer: Schurter; Mounting Technology: Surface Mount; PackageReference: 1206; PackageDescription: 1206 (3216 Metric)
Q4 = IRFS7530TRL7PP: N-Channel MOSFET; Manufacturer: Infineon; PackageReference: D2Pak-7PIN; PackageDescription: TO, Flat Index; 3 In-Line, Axial Leads; Body Dia. 4.6mm; Lead Dia. 0.5 mm (max); Published: 8-Jun-2000; LatestRevisionDate: 17-Jul-2002; LatestRevisionNote: Re-released for DXP Platform.; PackageVersion: 1995/1996; Publisher: Altium Limited; PartNumber: IRFS7530TRL7PP
Q5 Q7 = SI2309CDS-T1-GE3: P-Channel MOSFET; Manufacturer: Vishay; PackageReference: SOT23-3; Mounting Technology: Surface Mount; PartNumber: SI2309CDS-T1-GE3
Q6 = SIS862DN-T1-GE3: N-Channel MOSFET; Manufacturer: Vishay; PackageReference: PowerPAK-1212-8; PartNumber: SIS862DN-T1-GE3; Mounting Technology: Surface Mount
Q8 Q10-Q12 = BSS123WQ-7-F: as Q1 on sheet MCU; PackageReference: SOT-323-3; PartNumber: BSS123WQ-7-F; Mounting Technology: Surface Mount
Q9 = BSS84PW H6327: P-Channel MOSFET; Manufacturer: Infineon; Mounting Technology: Surface Mount; PartNumber: BSS84PWH6327XTSA1; PackageReference: SOT323-3
R38 = RES_51K_0603_1%: 51K 0.25W 1% 0603 (1005 Metric); Manufacturer: Vishay / Dale; PartNumber: CRCW060351K0FKEAHP; Power: 0.25W; Tolerance: 1%; Mounting Technology: Surface Mount; PackageReference: 0603; PackageDescription: 0603 (1608 Metric); ComponentLink1Description: Datasheet; ComponentLink1URL: http://www.vishay.com/docs/20043/crcwhpe3.pdf
R39 R46 R49 = RES_18K_0603_1%: 18K 0.25W 1% 0603 (1005 Metric); Manufacturer: Vishay / Dale; PartNumber: CRCW060318K0FKEAHP; Tolerance: 1%; Power: 0.25W; Mounting Technology: Surface Mount; PackageReference: 0603; PackageDescription: 0603 (1608 Metric); ComponentLink1Description: Datasheet; ComponentLink1URL: http://www.vishay.com/docs/20043/crcwhpe3.pdf
R40 = RES_4K7_0603_1%: as R14 on sheet MCU; Tolerance: 1%; Power: 0.25W; Mounting Technology: Surface Mount; PackageReference: 0603; PackageDescription: 0603 (1608 Metric); ComponentLink1Description: Datasheet; ComponentLink1URL: http://www.vishay.com/docs/20043/crcwhpe3.pdf
R41 R44 R45 R47 R48 R57 R60 = RES_10K_0603_1%: as R19 on sheet MCU; Tolerance: 1%; Power: 0.25W; Mounting Technology: Surface Mount; PackageReference: 0603; PackageDescription: 0603 (1608 Metric); ComponentLink1Description: Datasheet; ComponentLink1URL: http://www.vishay.com/docs/20065/rcse3.pdf
R42 R43 = RES_50R_1206_2%: 50R 2.4W 2% 1206 (3216 Metric); Manufacturer: Vishay; PartNumber: RCP1206W50R0GEB; Tolerance: 2%; Power: 2.4W; Mounting Technology: Surface Mount; PackageReference: 1206; PackageDescription: 1206 (3216 Metric); ComponentLink1Description: Datasheet; ComponentLink1URL: http://www.vishay.com/docs/31098/rcp.pdf
R50 R51 = RES_100R_0603_1%: as R82 on sheet 3V3; Power: 0.25W; Tolerance: 1%; Mounting Technology: Surface Mount; PackageReference: 0603; PackageDescription: 0603 (1608 Metric); ComponentLink1Description: Datasheet; ComponentLink1URL: http://www.vishay.com/docs/20043/crcwhpe3.pdf
R54-R56 = RES_10M_0603_1%: 10M 0.25W 1% 0603 (1005 Metric); Manufacturer: Vishay / Dale; Tolerance: 1%; Power: 0.25W; Mounting Technology: Surface Mount; PackageReference: 0603; PackageDescription: 0603 (1608 Metric); ComponentLink1Description: Datasheet; ComponentLink1URL: http://www.vishay.com/docs/20043/crcwhpe3.pdf
U7 = BQ76200PWR: Battery Management Fast high side NCH drive; Manufacturer: Texas Instruments; PartNumber: BQ76200PWR; PackageReference: TSSOP-16; Mounting Technology: Surface Mount

## Sheet Connectors.SchDoc
size A; SheetNumber: 13
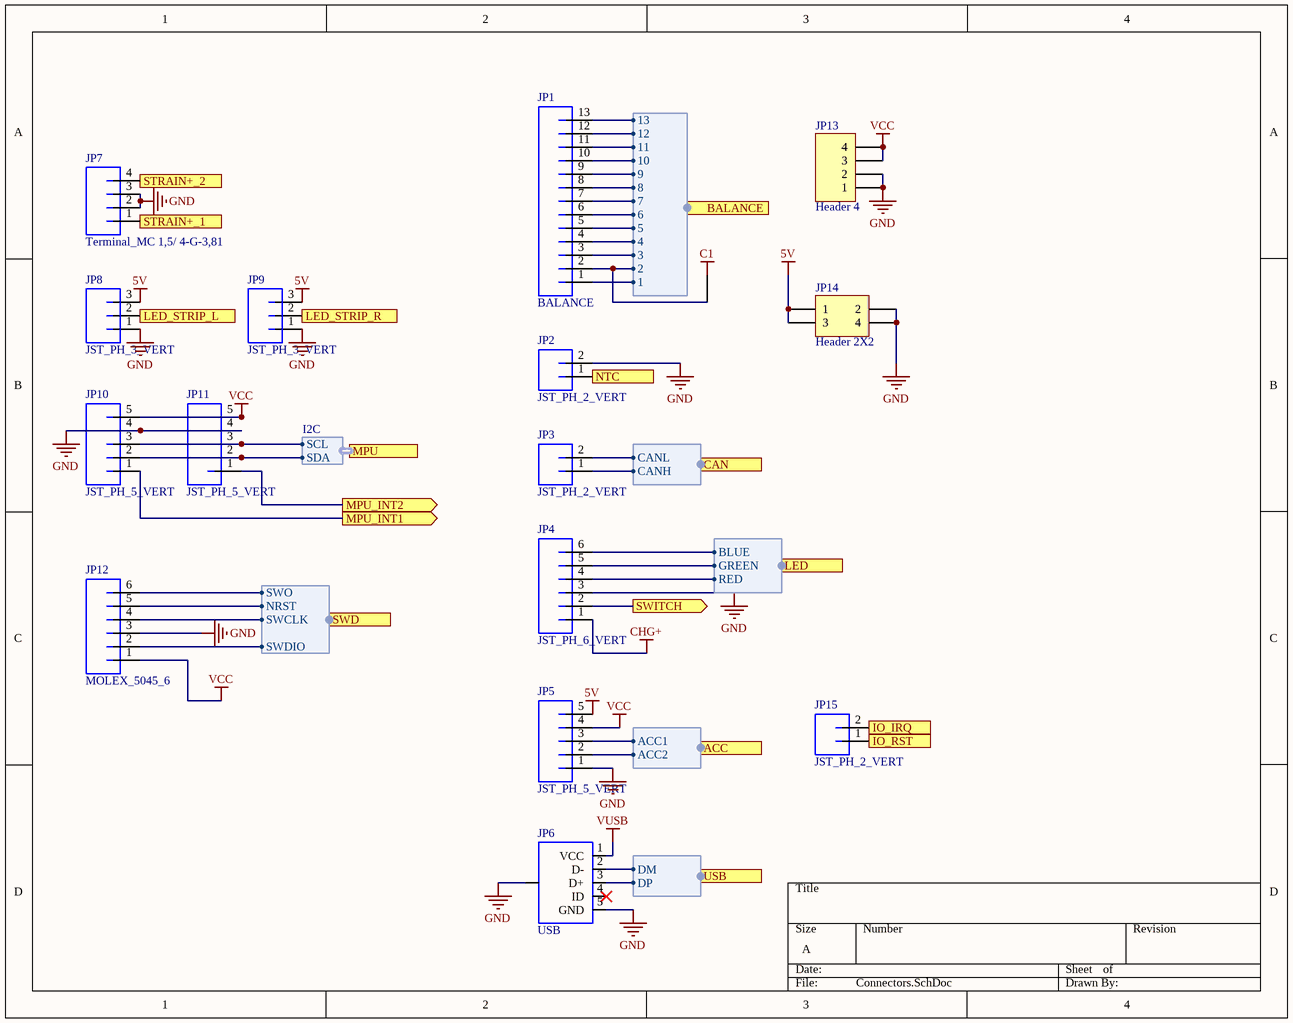
[diagram p4: Connectors.SchDoc]

### Parts
*1  NetTie  [NetTie]  (value not drawn)  (net tie, no BOM)
JP1  BALANCE  [JST-XH-13-PTH-VERT]
JP2  JST_PH_2_VERT  [JST-PH-2-PTH-VERT]
JP3  JST_PH_2_VERT  [JST-PH-2-PTH-VERT]
JP4  JST_PH_6_VERT  [JST-PH-6-PTH-VERT]
JP5  JST_PH_5_VERT  [JST-PH-5-PTH-VERT]
JP6  USB  [USB-MICROB_HORZ]
JP7  Terminal_MC 1,5/ 4-G-3,81  [Terminal-3.81-HORZ]
JP8  JST_PH_3_VERT  [JST-PH-3-PTH-VERT]
JP9  JST_PH_3_VERT  [JST-PH-3-PTH-VERT]
JP10  JST_PH_5_VERT  [JST-PH-5-PTH-VERT]
JP11  JST_PH_5_VERT  [JST-PH-5-PTH-VERT]
JP12  MOLEX_5045_6  [MOLEX_5045_6]
JP13  Header 4  [HDR1X4]
JP14  Header 2X2  [HDR2X2]
JP15  JST_PH_2_VERT  [JST-PH-2-PTH-VERT]

### Ports
ACC (harness Accessory Outputs), BALANCE (harness Balance), CAN (harness CAN Output), IO_IRQ (out), IO_RST (in), LED (harness LED), LED_STRIP_L (in), LED_STRIP_R (in), MPU (harness I2C), MPU_INT1 (out), MPU_INT2 (out), NTC (in), STRAIN+_1 (in), STRAIN+_2 (in), SWD (harness SWD), SWITCH (out), USB (harness USB)

### Harnesses
USB: DM, DP
Accessory Outputs: ACC1, ACC2
CAN Output: CANL, CANH
Balance: 13, 12, 11, 10, 9, 8, 6, 7, 5, 3, 4, 2, 1
I2C: SCL, SDA
SWD: SWCLK, SWDIO, SWO, NRST
LED: RED, BLUE, GREEN

### Nets
5V: JP5.5 JP8.3 JP9.3 JP14.1 JP14.3
C1: *1.2
CHG+: JP4.1
GND: JP2.2 JP4.3 JP5.1 JP6.5(GND) JP6.6(SHIELD) JP7.2 JP7.3 JP8.1 JP9.1 JP10.4 JP11.4 JP12.3 JP13.1 JP13.2 JP14.2 JP14.4
VCC: JP5.4 JP10.5 JP11.5 JP12.1 JP13.3 JP13.4
VUSB: JP6.1(VCC)
ACC.ACC1: JP5.3 ; port ACC.ACC1
ACC.ACC2: JP5.2 ; port ACC.ACC2
AINP: JP7.1 ; port STRAIN+_1
AINP: JP7.4 ; port STRAIN+_2  [a separate net that carries the same name]
CELL0: JP1.1 ; port BALANCE.1
CELL1: *1.1 JP1.2 ; port BALANCE.2
CELL2: JP1.3 ; port BALANCE.3
CELL3: JP1.4 ; port BALANCE.4
CELL4: JP1.5 ; port BALANCE.5
CELL5: JP1.6 ; port BALANCE.6
CELL6: JP1.7 ; port BALANCE.7
CELL7: JP1.8 ; port BALANCE.8
CELL8: JP1.9 ; port BALANCE.9
CELL9: JP1.10 ; port BALANCE.10
CELL10: JP1.11 ; port BALANCE.11
CELL11: JP1.12 ; port BALANCE.12
CELL12: JP1.13 ; port BALANCE.13
I2C2.SCL: JP10.3 JP11.3 ; port MPU.SCL
I2C2.SDA: JP10.2 JP11.2 ; port MPU.SDA
LED.BLUE: JP4.6 ; port LED.BLUE
LED.GREEN: JP4.5 ; port LED.GREEN
LED.RED: JP4.4 ; port LED.RED
SWD.NRST: JP12.5 ; port SWD.NRST
SWD.SWCLK: JP12.4 ; port SWD.SWCLK
SWD.SWDIO: JP12.2 ; port SWD.SWDIO
SWD.SWO: JP12.6 ; port SWD.SWO
USB.DM: JP6.2(D-) ; port USB.DM
USB.DP: JP6.3(D+) ; port USB.DP
NetC1_2: JP2.1 ; port NTC
NetJP3_1: JP3.1 ; port CAN.CANH
NetJP3_2: JP3.2 ; port CAN.CANL
NetJP4_2: JP4.2 ; port SWITCH
NetJP8_2: JP8.2 ; port LED_STRIP_L
NetJP9_2: JP9.2 ; port LED_STRIP_R
NetJP10_1: JP10.1 ; port MPU_INT1
NetJP11_1: JP11.1 ; port MPU_INT2
NetJP15_1: JP15.1 ; port IO_RST
NetJP15_2: JP15.2 ; port IO_IRQ

Not connected (* = marked no-connect by the designer): JP6 4(ID)*

### Library data of the parts
JP1 = JST_XH_13_VERT: Manufacturer: JST Sales America, Inc.; PartNumber: B13B-XH-A(LF)(SN); Mounting Technology: Through Hole; PackageReference: JST-XH
JP2 JP3 JP15 = JST_PH_2_VERT: Manufacturer: JST Sales America Inc.; PartNumber: B2B-PH-K-S(LF)(SN); Mounting Technology: Through Hole; PackageReference: JST-PH
JP4 = JST_PH_6_VERT: PartNumber: B6B-PH-K-S(LF)(SN); Manufacturer: JST Sales America Inc.; PackageReference: JST-PH; Mounting Technology: Through Hole
JP5 JP10 JP11 = JST_PH_5_VERT: Manufacturer: JST Sales America, Inc.; PartNumber: B5B-PH-K-S(LF)(SN); PackageReference: JST-PH; Mounting Technology: Through Hole
JP6 = USB_MICROB_SMT: pin to pad: 1>VBUS 2>D- 3>D+ 4>ID 5>GND 6>MT1+P$1+P$2+MT2; PartNumber: 10118192-0001LF; Manufacturer: Amphenol FCI; Mounting Technology: Surface Mount; PackageReference: USB - Micro B
JP7 = Terminal_MC 1,5/ 4-G-3,81: PartNumber: 1803293; Manufacturer: Phoenix Contact; MatePart: 1803594; PackageReference: MC; Mounting Technology: Through Hole
JP8 JP9 = JST_PH_3_VERT: Manufacturer: JST Sales America Inc.; PartNumber: B3B-PH-K-S(LF)(SN); Mounting Technology: Through Hole; PackageReference: JST-PH
JP12 = MOLEX_5045_6: PartNumber: B6B-PH-K-S(LF)(SN); Manufacturer: JST Sales America Inc.; PackageReference: JST-PH; Mounting Technology: Through Hole
JP13 = Header 4: Header, 4-Pin; LatestRevisionDate: 17-Jul-2002; LatestRevisionNote: Re-released for DXP Platform.; Publisher: Altium Limited
JP14 = Header 2X2: Header, 2-Pin, Dual row; LatestRevisionDate: 17-Jul-2002; LatestRevisionNote: Re-released for DXP Platform.; Publisher: Altium Limited

## Sheet CAN.SchDoc
size A; SheetNumber: 9
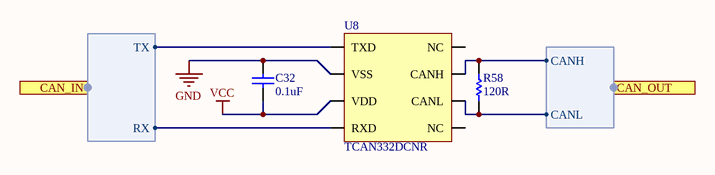
[diagram p5: CAN.SchDoc]

### Parts
C32  value 0.1uF  [C0603[1608X92]]  (hidden comment: 0.1uF 6.3V 0603)
R58  value 120R  [R0603[1608]]  (hidden comment: 120R 1% 0603)
U8  TCAN332DCNR  [SOT-23-8]

### Ports
CAN_IN (harness CAN Input), CAN_OUT (harness CAN Output)

### Harnesses
CAN Input: TX, RX
CAN Output: CANH, CANL

### Nets
GND: C32.2 U8.2(VSS)
VCC: C32.1 U8.3(VDD)
CAN.RX: U8.4(RXD) ; port CAN_IN.RX
CAN.TX: U8.1(TXD) ; port CAN_IN.TX
NetJP3_1: R58.2 U8.7(CANH) ; port CAN_OUT.CANH
NetJP3_2: R58.1 U8.6(CANL) ; port CAN_OUT.CANL

Not connected (* = marked no-connect by the designer): U8 5(NC) 8(NC)

### Library data of the parts
C32 = CAP_0.1uF_6.3V_0603_10%: as C47 on sheet 3V3; Mounting Technology: Surface Mount; PackageReference: 0603; PackageDescription: 0603 (1608 Metric); Voltage: 6.3V; Tolerance: 10%
R58 = RES_120R_0603_1%: 120R 0.25W 1% 0603 (1005 Metric); Manufacturer: Vishay / Dale; PartNumber: CRCW0603120RFKEAHP; Tolerance: 1%; Power: 0.25W; Mounting Technology: Surface Mount; PackageReference: 0603; PackageDescription: 0603 (1608 Metric); ComponentLink1Description: Datasheet; ComponentLink1URL: http://www.vishay.com/docs/20043/crcwhpe3.pdf
U8 = TCAN332DCNR: CAN Interface IC 3.3-V CAN Transceivers with CAN FD (Flexible Data Rate) 8-SOT-23 -40 to 125; Manufacturer: Texas Instruments; Mounting Technology: Surface Mount; PackageReference: SOT-23-8; PackageDescription: SOT23, 8-Leads; PartNumber: TCAN332DCNR

## Sheet RTCC.SchDoc
size A; SheetNumber: 10
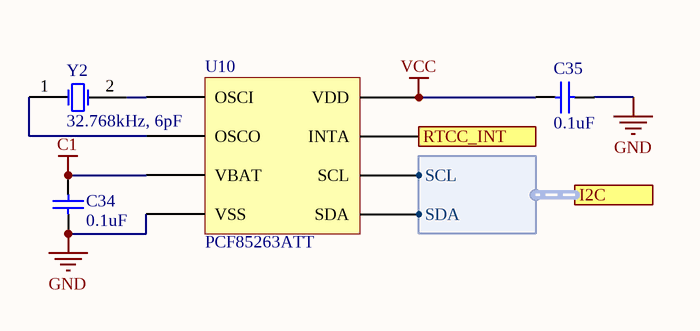
[diagram p6: RTCC.SchDoc]

### Parts
C34  value 0.1uF  [C0603[1608X92]]  (hidden comment: 0.1uF 6.3V 0603)
C35  value 0.1uF  [C0603[1608X92]]  (hidden comment: 0.1uF 6.3V 0603)
U10  PCF85263ATT  [TSSOP-8]
Y2  32.768kHz, 6pF  [ST3215SB]

### Ports
I2C (harness I2C), RTCC_INT (out)

### Harnesses
I2C: SCL, SDA

### Nets
C1: C34.2 U10.3(VBAT)
GND: C34.1 C35.2 U10.4(VSS)
VCC: C35.1 U10.8(VDD)
I2C3.SCL: U10.6(SCL) ; port I2C.SCL
I2C3.SDA: U10.5(SDA) ; port I2C.SDA
NetQ9_1: U10.7(INTA) ; port RTCC_INT
NetU10_1: U10.1(OSCI) Y2.2(X2)
NetU10_2: U10.2(OSCO) Y2.1(X1)

### Library data of the parts
C34 C35 = CAP_0.1uF_6.3V_0603_10%: as C47 on sheet 3V3; Mounting Technology: Surface Mount; PackageReference: 0603; PackageDescription: 0603 (1608 Metric); Voltage: 6.3V; Tolerance: 10%
U10 = PCF85263ATT: Real Time Clock Real-Time Clock calendar; PartNumber: PCF85263ATT/AJ; Manufacturer: Texas Instruments; Mounting Technology: Surface Mount; PackageReference: TSSOP-8
Y2 = ST3215SB32768B0HPWB3: 32.768kHz ±20ppm Crystal 6pF 60 kOhm -40°C ~ 85°C Surface Mount 2-SMD, No Lead (DFN, LCC); Manufacturer: AVX/Kyocera; PackageDescription: 2-SMD, No Lead (DFN, LCC); PackageReference: ST3215SB; Mounting Technology: Surface Mount; PartNumber: ST3215SB32768B0HPWB3

## Sheet Buzzer.SchDoc
size A; SheetNumber: 11
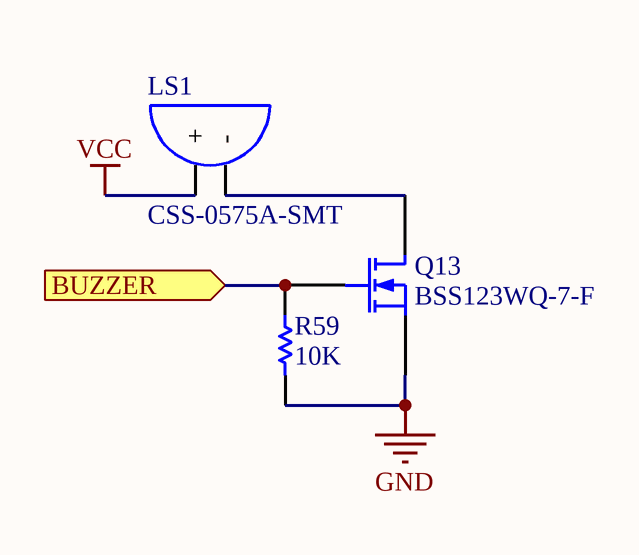
[diagram p7: Buzzer.SchDoc]

### Parts
LS1  CSS-0575A-SMT  [CSS-0575A-SMT]
Q13  BSS123WQ-7-F  [SOT323-3]
R59  value 10K  [R0603[1608]]  (hidden comment: 10K 1% 0603)

### Ports
BUZZER (in)

### Nets
GND: Q13.2(S) R59.1
VCC: LS1.1(+)
NetLS1_2: LS1.2(-) Q13.3(D)
NetQ13_1: Q13.1(G) R59.2 ; port BUZZER

### Library data of the parts
LS1 = CSS-0575A-SMT: Magnetic Buzzer Transducer; Manufacturer: CUI, Inc.; PartNumber: CSS-0575A-SMT; Mounting Technology: Surface Mount; PackageReference: 5x5x1.9mm
Q13 = BSS123WQ-7-F: as Q1 on sheet MCU; PackageReference: SOT-323-3; PartNumber: BSS123WQ-7-F; Mounting Technology: Surface Mount
R59 = RES_10K_0603_1%: as R19 on sheet MCU; Tolerance: 1%; Power: 0.25W; Mounting Technology: Surface Mount; PackageReference: 0603; PackageDescription: 0603 (1608 Metric); ComponentLink1Description: Datasheet; ComponentLink1URL: http://www.vishay.com/docs/20065/rcse3.pdf

## Sheet ADC.SchDoc
size A4
Used 2 times, as channels A_L, A_R. Parts and nets are listed once, with the designators drawn on the sheet.
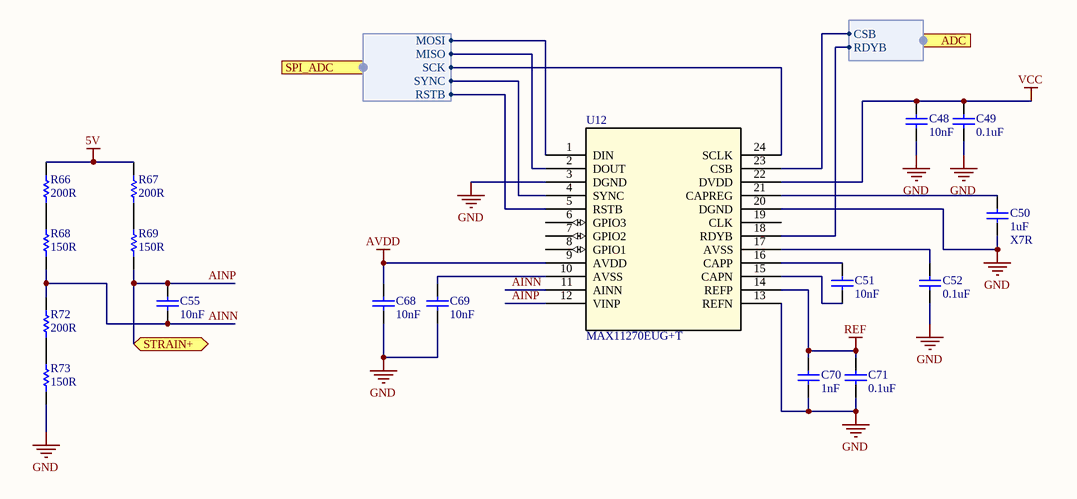
[diagram p8: ADC.SchDoc]

### Parts
C48  value 10nF  [C0603[1608X92]]  (hidden comment: 10nF 6.3V 0603)
C49  value 0.1uF  [C0603[1608X92]]  (hidden comment: 0.1uF 6.3V 0603)
C50  value 1uF  TemperatureCoefficient: X7R  [C0603[1608X92]]  (hidden comment: 1uF 16V 0603 X7R)
C51  value 10nF  [C0603[1608X92]]  (hidden comment: 10nF 6.3V 0603)
C52  value 0.1uF  [C0603[1608X92]]  (hidden comment: 0.1uF 6.3V 0603)
C55  value 10nF  [C0603[1608X92]]  (hidden comment: 10nF 6.3V 0603)
C68  value 10nF  [C0603[1608X92]]  (hidden comment: 10nF 6.3V 0603)
C69  value 10nF  [C0603[1608X92]]  (hidden comment: 10nF 6.3V 0603)
C70  value 1nF  [C0603[1608X92]]  (hidden comment: 1nF 6.3V 0603)
C71  value 0.1uF  [C0603[1608X92]]  (hidden comment: 0.1uF 6.3V 0603)
R66  value 200R  [R0603[1608]]  (hidden comment: 200R 1% 0603)
R67  value 200R  [R0603[1608]]  (hidden comment: 200R 1% 0603)
R68  value 150R  [R0603[1608]]  (hidden comment: 150R 1% 0603)
R69  value 150R  [R0603[1608]]  (hidden comment: 150R 1% 0603)
R72  value 200R  [R0603[1608]]  (hidden comment: 200R 1% 0603)
R73  value 150R  [R0603[1608]]  (hidden comment: 150R 1% 0603)
U12  MAX11270EUG+T  [21-0066J_24]

### Ports
ADC (harness ADC), SPI_ADC (harness SPI_ADC), STRAIN+ (bidir)

### Harnesses
SPI_ADC: MOSI, MISO, SCK, SYNC, RSTB
ADC: CSB, RDYB

### Nets
5V: R66.2 R67.2
AVDD: C68.2 U12.9(AVDD)
GND: C48.1 C49.1 C50.1 C52.1 C68.1 C69.1 C70.1 C71.1 R73.1 U12.3(DGND) U12.13(REFN) U12.20(DGND)
REF: C70.2 C71.2 U12.14(REFP)
VCC: C48.2 C49.2 U12.22(DVDD)
AINN: C55.1 R68.1 R72.2 U12.11(AINN)
AINP: C55.2 R69.1 U12.12(VINP) ; port STRAIN+
NetC50_2: C50.2 U12.21(CAPREG)
NetC51_1: C51.1 U12.15(CAPN)
NetC51_2: C51.2 U12.16(CAPP)
NetC52_2: C52.2 U12.17(AVSS)
NetC69_2: C69.2 U12.10(AVSS)
NetR66_1: R66.1 R68.2
NetR67_1: R67.1 R69.2
NetR72_1: R72.1 R73.2
NetU12_1: U12.1(DIN) ; port SPI_ADC.MOSI
NetU12_2: U12.2(DOUT) ; port SPI_ADC.MISO
NetU12_4: U12.4(SYNC) ; port SPI_ADC.SYNC
NetU12_5: U12.5(RSTB) ; port SPI_ADC.RSTB
NetU12_18: U12.18(RDYB) ; port ADC.RDYB
NetU12_23: U12.23(CSB) ; port ADC.CSB
NetU12_24: U12.24(SCLK) ; port SPI_ADC.SCK

Not connected (* = marked no-connect by the designer): U12 6(GPIO3) 7(GPIO2) 8(GPIO1) 19(CLK)

### Channels
A_L: designators end in _A_L; ports STRAIN+=AINP
A_R: designators end in _A_R; ports STRAIN+=AINP

### Library data of the parts
C48 C51 C55 C68 C69 = CAP_10nF_6.3V_0603_10%: 10nF 6.3V 10% 0603 (1608 Metric); PartNumber: GRM188R70J103KA01D; Manufacturer: Murata; TemperatureCoefficient: X7R; Mounting Technology: Surface Mount; PackageReference: 0603; PackageDescription: 0603 (1608 Metric); Voltage: 6.3V; Tolerance: 10%
C49 C52 C71 = CAP_0.1uF_6.3V_0603_10%: as C47 on sheet 3V3; Mounting Technology: Surface Mount; PackageReference: 0603; PackageDescription: 0603 (1608 Metric); Voltage: 6.3V; Tolerance: 10%
C50 = CAP_1uF_16V_0603_10%_X7R: 1uF 16V 10% 0603 X7R (1608 Metric); PartNumber: GCJ188R71E105KA01D; Manufacturer: Murata; Mounting Technology: Surface Mount; PackageReference: 0603; PackageDescription: 0603 (1608 Metric); Voltage: 16V; Tolerance: 10%
C70 = CAP_1nF_6.3V_0603_5%: 1nF 6.3V 5% 0603 (1608 Metric); PartNumber: GRM1885C1H102JA01D; Manufacturer: Murata; TemperatureCoefficient: C0G; Mounting Technology: Surface Mount; PackageReference: 0603; PackageDescription: 0603 (1608 Metric); Voltage: 6.3V; Tolerance: 5%
R66 R67 R72 = RES_200R_0603_1%: as R81 on sheet 3V3; Tolerance: 1%; Power: 0.25W; Mounting Technology: Surface Mount; PackageReference: 0603; PackageDescription: 0603 (1608 Metric); ComponentLink1Description: Datasheet; ComponentLink1URL: http://www.vishay.com/docs/20043/crcwhpe3.pdf
R68 R69 R73 = RES_150R_0603_1%: as R37 on sheet 3V3; Tolerance: 1%; Power: 0.25W; Mounting Technology: Surface Mount; PackageReference: 0603; PackageDescription: 0603 (1608 Metric); ComponentLink1Description: Datasheet; ComponentLink1URL: http://www.vishay.com/docs/20043/crcwhpe3.pdf
U12 = MAX11270EUG+T: Imported; PartNumber: MAX111270EUG+T; Manufacturer: Maxim; Value: Value; Type: Type; RefDes: RefDes